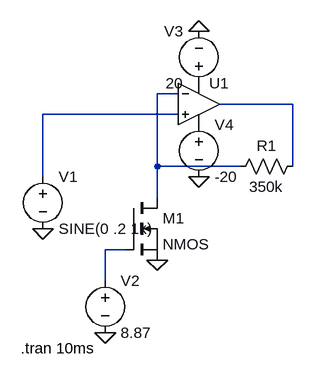
[diagram p0: schematic Part1.asc]
Part1.asc, the LTspice schematic file:
Version 4
SHEET 1 880 680
WIRE 272 -16 240 -16
WIRE 448 0 336 0
WIRE 272 16 64 16
WIRE 240 96 240 -16
WIRE 368 96 240 96
WIRE 448 96 448 0
WIRE 64 112 64 16
WIRE 240 144 240 96
WIRE 192 224 160 224
WIRE 160 272 160 224
FLAG 64 192 0
FLAG 240 240 0
FLAG 160 352 0
FLAG 304 -112 0
FLAG 304 112 0
SYMBOL voltage 64 96 R0
WINDOW 123 0 0 Left 0
WINDOW 39 0 0 Left 0
SYMATTR InstName V1
SYMATTR Value SINE(0 .2 1k)
SYMBOL OpAmps\\UniversalOpAmp 304 0 R0
SYMATTR InstName U1
SYMBOL res 464 80 R90
WINDOW 0 0 56 VBottom 2
WINDOW 3 32 56 VTop 2
SYMATTR InstName R1
SYMATTR Value 350k
SYMBOL nmos 192 144 R0
SYMATTR InstName M1
SYMBOL voltage 160 256 R0
WINDOW 123 0 0 Left 0
WINDOW 39 0 0 Left 0
SYMATTR InstName V2
SYMATTR Value 8.87
SYMBOL voltage 304 -16 R180
WINDOW 0 24 96 Left 2
WINDOW 3 24 16 Left 2
WINDOW 123 0 0 Left 0
WINDOW 39 0 0 Left 0
SYMATTR InstName V3
SYMATTR Value 20
SYMBOL voltage 304 16 R0
WINDOW 123 0 0 Left 0
WINDOW 39 0 0 Left 0
SYMATTR InstName V4
SYMATTR Value -20
TEXT 30 376 Left 2 !.tran 10ms

The netlist it stands for:
* Part1.asc
V1 N003 0 SINE(0 .2 1k)
XU1 N003 N001 P001 P002 N002 level1 Avol=1Meg GBW=10Meg Vos=0 En=0 Enk=0 In=0 Ink=0 Rin=500Meg  ; pins In+ In- V+ V- OUT
R1 N002 N001 350k
M1 N001 N004 0 0 NMOS
V2 N004 0 8.87
V3 P001 0 20
V4 P002 0 -20
.model NMOS NMOS
.model PMOS PMOS
.lib standard.mos
.tran 10ms
.lib UniversalOpAmp1.lib
.backanno
.end